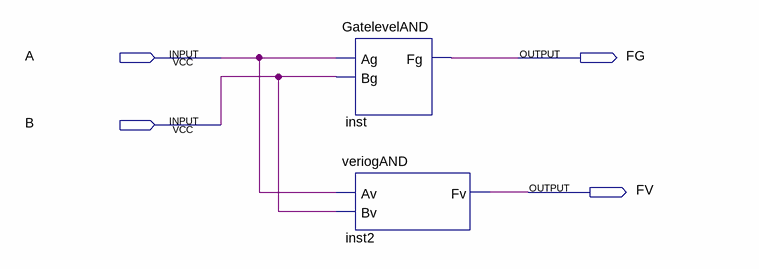
[diagram p0: schematic sheet]
// Quartus schematic AndGate.bdf as structural Verilog: 2 symbols, 4 pins
module AndGate (
  input  A,
  input  B,
  output FG,
  output FV
);

  GatelevelAND inst (.Ag(A), .Bg(B), .Fg(FG));
  veriogAND inst2 (.Av(A), .Bv(B), .Fv(FV));
endmodule
